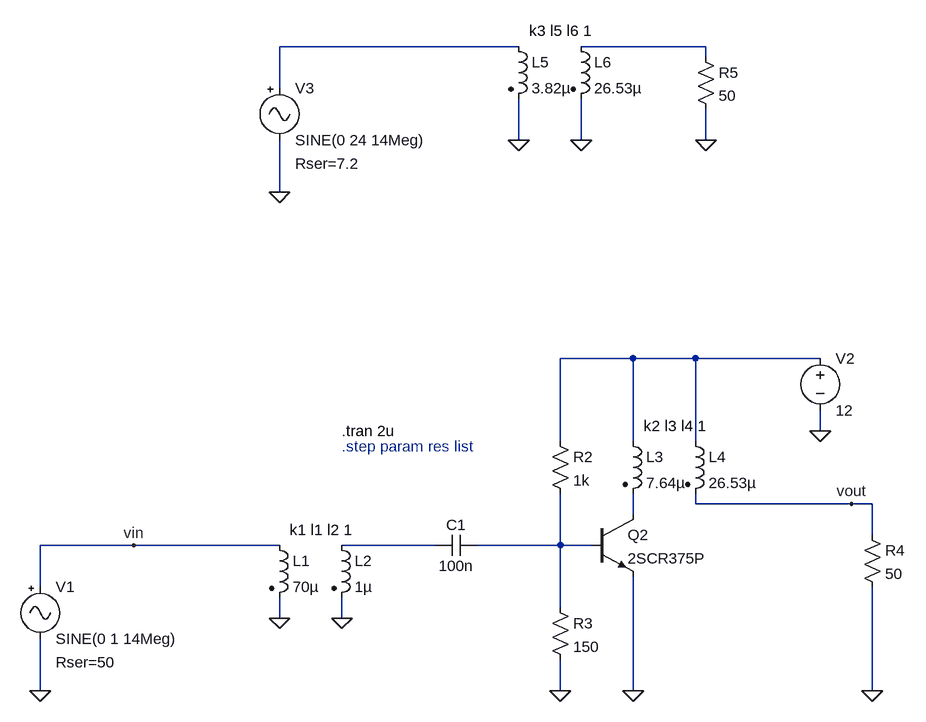
[diagram p0: schematic 5W QRP Amplifier from ZL2CTM.asc]
5W QRP Amplifier from ZL2CTM.asc, the LTspice schematic file:
Version 4
SHEET 1 2132 680
WIRE 832 -720 464 -720
WIRE 1120 -720 928 -720
WIRE 1120 -704 1120 -720
WIRE 464 -656 464 -720
WIRE 832 -576 832 -640
WIRE 928 -576 928 -640
WIRE 1120 -576 1120 -624
WIRE 464 -496 464 -576
WIRE 1008 -240 896 -240
WIRE 1104 -240 1008 -240
WIRE 1296 -240 1104 -240
WIRE 1296 -128 1296 -160
WIRE 896 -112 896 -240
WIRE 1008 -112 1008 -240
WIRE 1104 -112 1104 -240
WIRE 1104 -16 1104 -32
WIRE 1344 -16 1104 -16
WIRE 1376 -16 1344 -16
WIRE 1008 0 1008 -32
WIRE 1376 32 1376 -16
WIRE 240 48 96 48
WIRE 464 48 240 48
WIRE 704 48 560 48
WIRE 896 48 896 -32
WIRE 896 48 768 48
WIRE 944 48 896 48
WIRE 96 112 96 48
WIRE 896 144 896 48
WIRE 464 160 464 128
WIRE 560 160 560 128
WIRE 96 272 96 192
WIRE 896 272 896 224
WIRE 1008 272 1008 96
WIRE 1376 272 1376 112
FLAG 96 272 0
FLAG 896 272 0
FLAG 1008 272 0
FLAG 1376 272 0
FLAG 1296 -128 0
FLAG 832 -576 0
FLAG 928 -576 0
FLAG 464 -496 0
FLAG 1120 -576 0
FLAG 1344 -16 vout
FLAG 464 160 0
FLAG 560 160 0
FLAG 240 48 vin
SYMBOL Misc\\signal 96 96 R0
WINDOW 123 0 0 Left 0
WINDOW 39 24 132 Left 2
SYMATTR SpiceLine Rser=50
SYMATTR InstName V1
SYMATTR Value SINE(0 1 14Meg)
SYMBOL res 880 -128 R0
SYMATTR InstName R2
SYMATTR Value 1k
SYMBOL res 880 128 R0
SYMATTR InstName R3
SYMATTR Value 150
SYMBOL npn 944 0 R0
SYMATTR InstName Q2
SYMATTR Value 2SCR375P
SYMBOL ind2 992 -128 R0
SYMATTR InstName L3
SYMATTR Value 7.64µ
SYMATTR Type ind
SYMBOL ind2 1088 -128 R0
SYMATTR InstName L4
SYMATTR Value 26.53µ
SYMATTR Type ind
SYMBOL res 1360 16 R0
SYMATTR InstName R4
SYMATTR Value 50
SYMBOL voltage 1296 -256 R0
WINDOW 123 0 0 Left 0
WINDOW 39 0 0 Left 0
SYMATTR InstName V2
SYMATTR Value 12
SYMBOL ind2 816 -736 R0
SYMATTR InstName L5
SYMATTR Value 3.82µ
SYMATTR Type ind
SYMBOL ind2 912 -736 R0
SYMATTR InstName L6
SYMATTR Value 26.53µ
SYMATTR Type ind
SYMBOL Misc\\signal 464 -672 R0
WINDOW 123 0 0 Left 0
WINDOW 39 24 132 Left 2
SYMATTR SpiceLine Rser=7.2
SYMATTR InstName V3
SYMATTR Value SINE(0 24 14Meg)
SYMBOL res 1104 -720 R0
SYMATTR InstName R5
SYMATTR Value 50
SYMBOL ind2 448 32 R0
SYMATTR InstName L1
SYMATTR Value 70µ
SYMATTR Type ind
SYMBOL ind2 544 32 R0
SYMATTR InstName L2
SYMATTR Value 1µ
SYMATTR Type ind
SYMBOL cap 768 32 R90
WINDOW 0 0 32 VBottom 2
WINDOW 3 32 32 VTop 2
SYMATTR InstName C1
SYMATTR Value 100n
TEXT 1024 -136 Left 2 !k2 l3 l4 1
TEXT 560 -128 Left 2 !.tran 2u
TEXT 848 -744 Left 2 !k3 l5 l6 1
TEXT 560 -104 Left 2 ;.step param res list
TEXT 480 24 Left 2 !k1 l1 l2 1

The netlist it stands for:
* 5W QRP Amplifier from ZL2CTM.asc
V1 vin 0 SINE(0 1 14Meg) Rser=50
R2 N003 N006 1k
R3 N006 0 150
Q2 N004 N006 0 0 2SCR375P
L3 N003 N004 7.64µ
L4 N003 vout 26.53µ
R4 vout 0 50
V2 N003 0 12
L5 N001 0 3.82µ
L6 N002 0 26.53µ
V3 N001 0 SINE(0 24 14Meg) Rser=7.2
R5 N002 0 50
L1 vin 0 70µ
L2 N005 0 1µ
C1 N006 N005 100n
.model NPN NPN
.model PNP PNP
.lib standard.bjt
k2 l3 l4 1
.tran 2u
k3 l5 l6 1
* .step param res list
k1 l1 l2 1
.backanno
.end